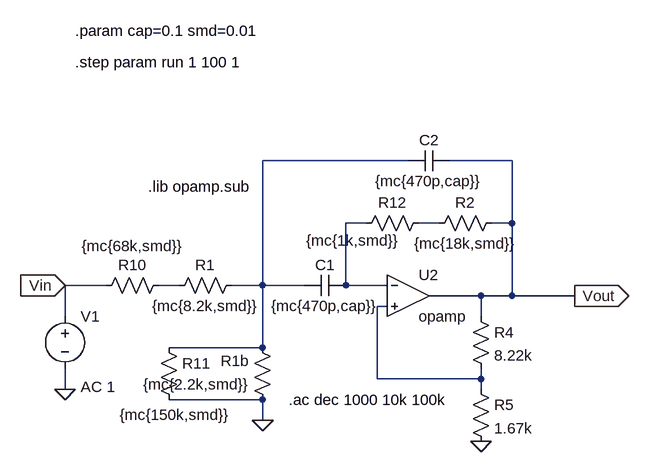
[diagram p0: schematic cell1_build.asc]
cell1_build.asc, the LTspice schematic file:
Version 4
SHEET 1 1440 680
WIRE 448 -32 224 -32
WIRE 608 -32 512 -32
WIRE 384 64 352 64
WIRE 496 64 464 64
WIRE 608 64 608 -32
WIRE 608 64 576 64
WIRE -16 160 -80 160
WIRE 96 160 64 160
WIRE 224 160 224 -32
WIRE 224 160 176 160
WIRE 288 160 224 160
WIRE 352 160 352 64
WIRE 416 160 352 160
WIRE 560 176 480 176
WIRE 608 176 608 64
WIRE 608 176 560 176
WIRE 704 176 608 176
WIRE 416 192 400 192
WIRE -80 208 -80 160
WIRE 560 208 560 176
WIRE 224 256 224 160
WIRE 224 256 80 256
WIRE 400 304 400 192
WIRE 560 304 560 288
WIRE 560 304 400 304
WIRE -80 320 -80 288
WIRE 560 320 560 304
WIRE 224 336 80 336
WIRE 224 368 224 336
FLAG 224 368 0
FLAG 560 400 0
FLAG -80 320 0
FLAG -80 160 Vin
IOPIN -80 160 In
FLAG 704 176 Vout
IOPIN 704 176 Out
SYMBOL res 192 144 R90
WINDOW 0 0 56 VBottom 2
WINDOW 3 32 56 VTop 2
SYMATTR InstName R1
SYMATTR Value {mc{8.2k,smd}}
SYMBOL res 240 352 R180
WINDOW 0 36 76 Left 2
WINDOW 3 36 40 Left 2
SYMATTR InstName R1b
SYMATTR Value {mc{2.2k,smd}}
SYMBOL res 592 48 R90
WINDOW 0 0 56 VBottom 2
WINDOW 3 32 56 VTop 2
SYMATTR InstName R2
SYMATTR Value {mc{18k,smd}}
SYMBOL res 544 192 R0
SYMATTR InstName R4
SYMATTR Value 8.22k
SYMBOL res 544 304 R0
SYMATTR InstName R5
SYMATTR Value 1.67k
SYMBOL cap 352 144 R90
WINDOW 0 0 32 VBottom 2
WINDOW 3 32 32 VTop 2
SYMATTR InstName C1
SYMATTR Value {mc{470p,cap}}
SYMBOL cap 512 -48 R90
WINDOW 0 0 32 VBottom 2
WINDOW 3 32 32 VTop 2
SYMATTR InstName C2
SYMATTR Value {mc{470p,cap}}
SYMBOL Opamps\\opamp 448 112 R0
SYMATTR InstName U2
SYMBOL voltage -80 192 R0
WINDOW 123 24 124 Left 2
WINDOW 39 0 0 Left 0
SYMATTR Value2 AC 1
SYMATTR InstName V1
SYMATTR Value ""
SYMBOL res 80 144 R90
WINDOW 0 0 56 VBottom 2
WINDOW 3 -60 56 VTop 2
SYMATTR InstName R10
SYMATTR Value {mc{68k,smd}}
SYMBOL res 64 240 R0
WINDOW 3 -60 119 Left 2
SYMATTR Value {mc{150k,smd}}
SYMATTR InstName R11
SYMBOL res 480 48 R90
WINDOW 0 0 56 VBottom 2
WINDOW 3 27 117 VTop 2
SYMATTR InstName R12
SYMATTR Value {mc{1k,smd}}
TEXT 264 336 Left 2 !.ac dec 1000 10k 100k
TEXT 48 8 Left 2 !.lib opamp.sub
TEXT -64 -232 Left 2 !.param cap=0.1 smd=0.01
TEXT -64 -184 Left 2 !.step param run 1 100 1

The netlist it stands for:
* cell1_build.asc
R1 N001 N004 {mc{8.2k,smd}}
R1b 0 N001 {mc{2.2k,smd}}
R2 Vout N003 {mc{18k,smd}}
R4 Vout N005 8.22k
R5 N005 0 1.67k
C1 N002 N001 {mc{470p,cap}}
C2 Vout N001 {mc{470p,cap}}
XU2 N002 N005 Vout opamp Aol=100K GBW=10Meg  ; pins invin noninvin out
V1 Vin 0 AC 1
R10 N004 Vin {mc{68k,smd}}
R11 N001 0 {mc{150k,smd}}
R12 N003 N002 {mc{1k,smd}}
.ac dec 1000 10k 100k
.lib opamp.sub
.param cap=0.1 smd=0.01
.step param run 1 100 1
.backanno
.end